# Altium schematic sheet MCP9808T.SchDoc
size A4
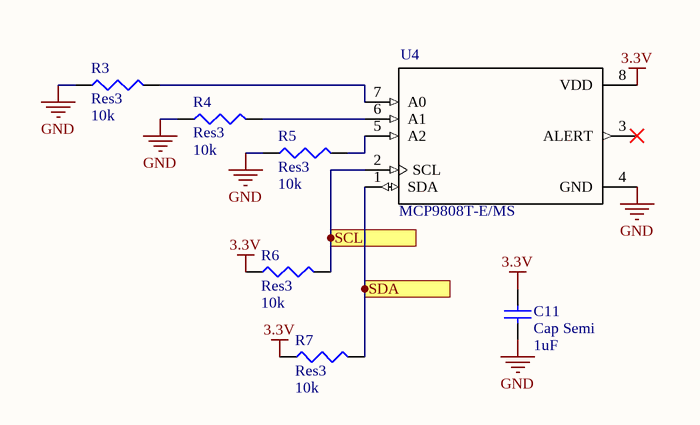
[diagram p0: MCP9808T.SchDoc]

## Parts
C11  Cap Semi  value 1uF  [C1206]
R3  Res3  value 10k  [6-0805_L]
R4  Res3  value 10k  [6-0805_L]
R5  Res3  value 10k  [6-0805_L]
R6  Res3  value 10k  [6-0805_L]
R7  Res3  value 10k  [6-0805_L]
U4  MCP9808T-E/MS  [*SOP65P490X110-8N]

## Ports
SCL, SDA

## Nets
3.3V: C11.2 R6.1 R7.1 U4.8(VDD)
GND: C11.1 R3.1 R4.1 R5.1 U4.4(GND)
SCL: R6.2 U4.2(SCL) ; port SCL
SDA: R7.2 U4.1(SDA) ; port SDA
NetR3_2: R3.2 U4.7(A0)
NetR4_2: R4.2 U4.6(A1)
NetR5_2: R5.2 U4.5(A2)

Not connected (* = marked no-connect by the designer): U4 3(ALERT)*

## Library data of the parts
C11 = Cap Semi: Capacitor (Semiconductor SIM Model); SPN: 732-7692-1-ND; Published: 8-Jun-2000; LatestRevisionDate: 29-May-2009; LatestRevisionNote: IPC-7351 Footprint Added.; PackageReference: C1206; Publisher: Altium Limited; PackageDescription: Chip Capacitor
R3-R7 = Res3: Resistor; SPN: RNCP0805FTD10K0CT-ND; Published: 8-Jun-2000; LatestRevisionDate: 29-May-2009; LatestRevisionNote: IPC-7351 Footprint Added.; PackageReference: J1-0603; Publisher: Altium Limited; PackageDescription: Chip Resistor
U4 = MCP9808T-E/MS: MCP9808 Series 3.6 V Memory Module Digital Temperature Sensor SMT - MSOP-8; MF: Microchip; SPN: MCP9808T-E/MSCT-ND; MP: MCP9808T-E/MS; Availability: Unavailable; SnapEDA_Link: https://www.snapeda.com/parts/MCP9808T-E/MS/Microchip/view-part/?ref=snap; Package: MSOP-8 Microchip; Price: None; Value: *